# EAGLE design 3K_valdiklis_v1.2 (EAGLE 6.4)
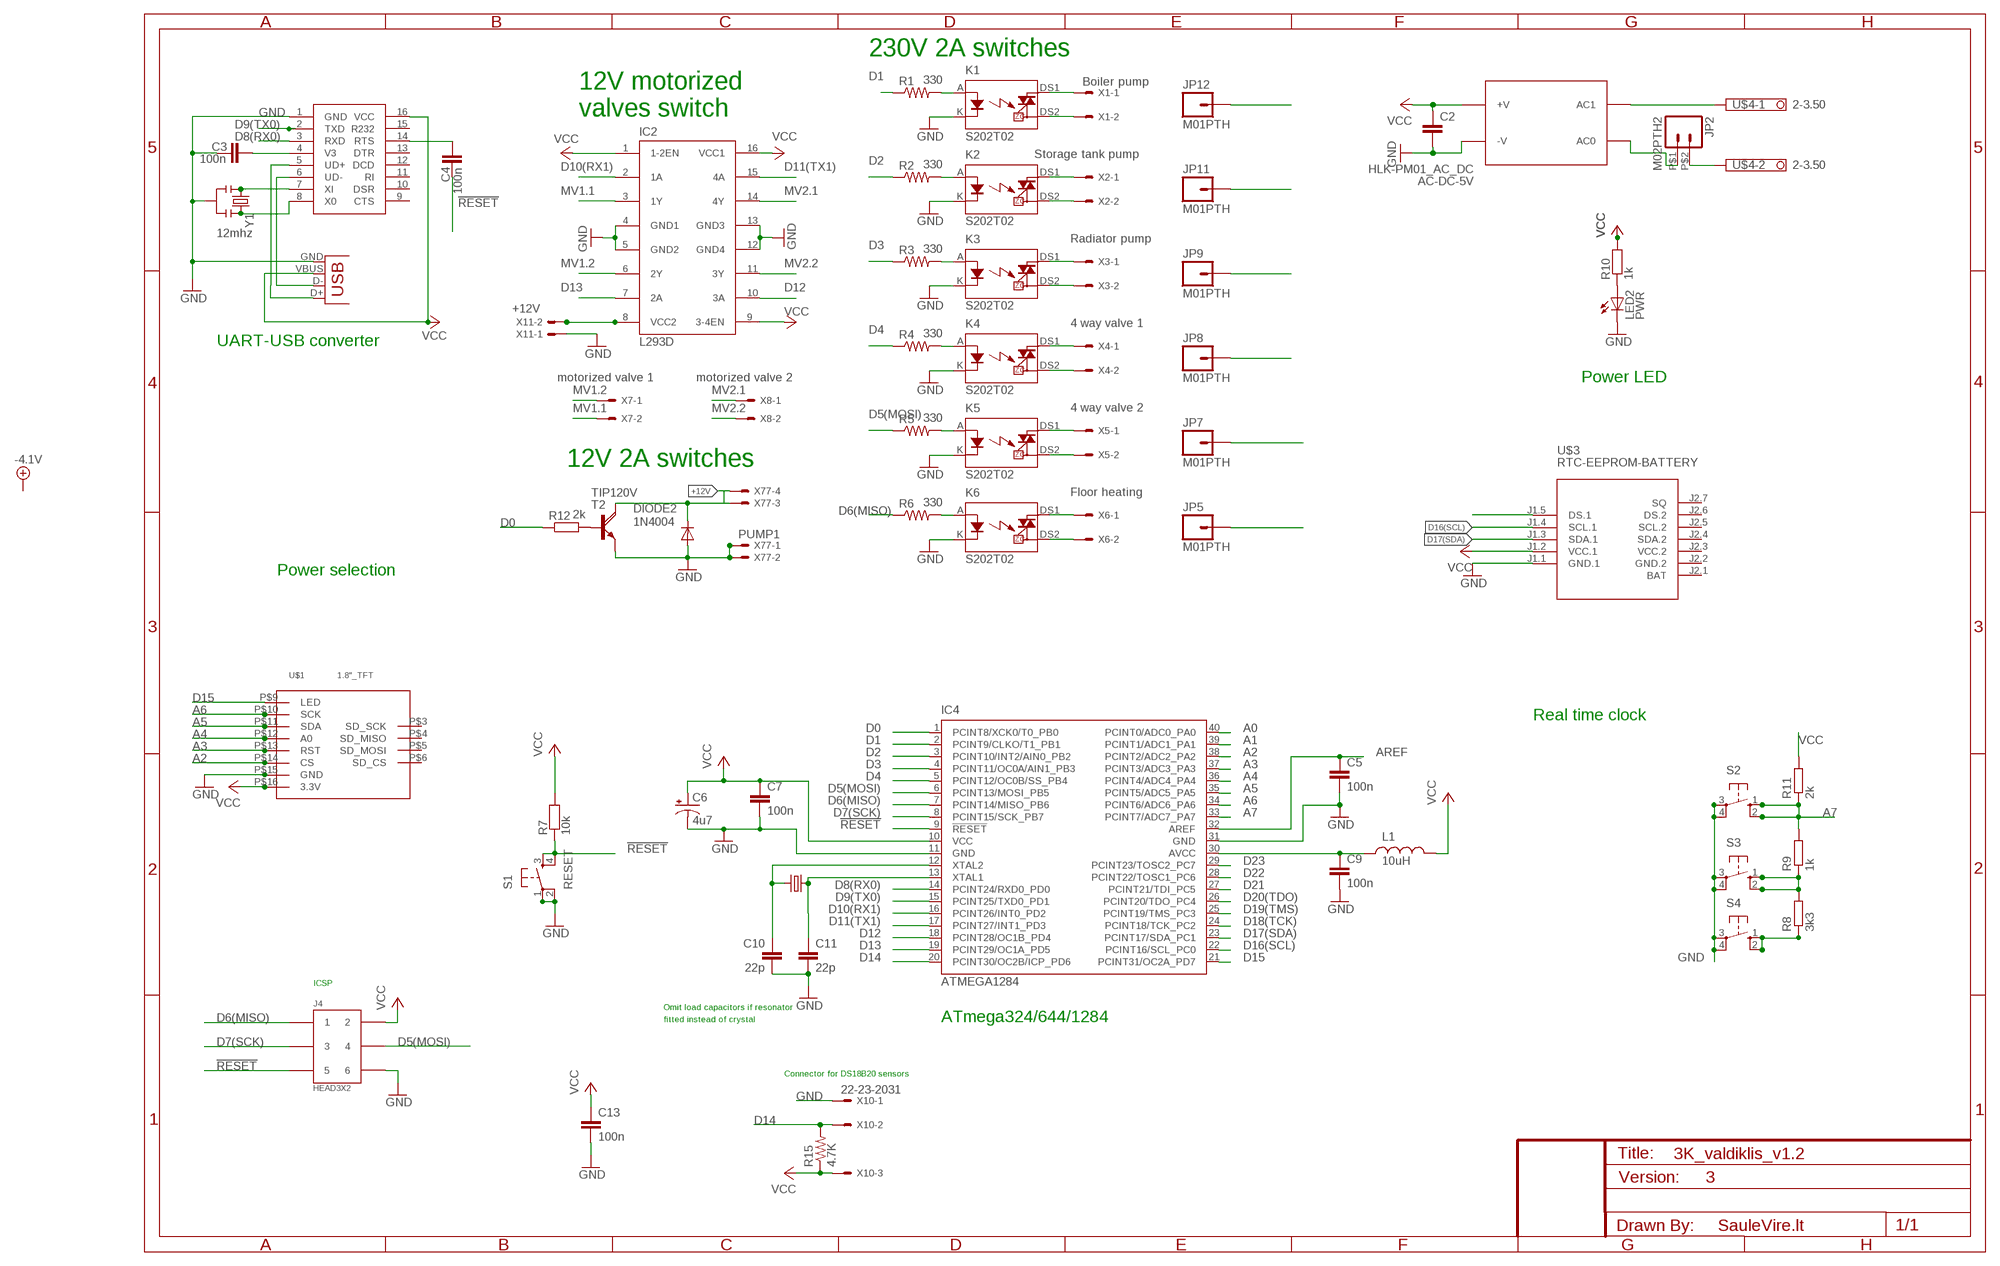
[diagram p0: schematic, sheet 1]

## Parts
AC-DC-5V  HLK-PM01_AC_DC  [HLK-PM01_AC_DC]
C2  C-EU025-024X044  [C025-024X044]
C3  100n  CAPPTH  [CAP-PTH-SMALL]
C4  100n  CAPPTH  [CAP-PTH-SMALL]
C5  100n  CAPPTH  [CAP-PTH-SMALL]
C6  4u7  CAP_POLPTH2  [CPOL-RADIAL-10UF-25V]
C7  100n  CAPPTH  [CAP-PTH-SMALL]
C9  100n  CAPPTH  [CAP-PTH-SMALL]
C10  22p  CAPPTH  [CAP-PTH-SMALL]
C11  22p  CAPPTH  [CAP-PTH-SMALL]
C13  100n  CAPPTH  [CAP-PTH-SMALL]
DIODE2  1N4004  [DO41-10]
IC2  L293D  [DIL16]
IC4  ATMEGA1284  ATMEGA644-20PU  [DIL40]
J4  HEAD3X2  [HEAD3X2]
JP2  M02PTH2  [1X02_BIG]
JP3  USB-B  USBPTH  [USB-B-PTH]
JP5  M01PTH  [1X01]
JP7  M01PTH  [1X01]
JP8  M01PTH  [1X01]
JP9  M01PTH  [1X01]
JP11  M01PTH  [1X01]
JP12  M01PTH  [1X01]
K1  S202T02  [S202T02]
K2  S202T02  [S202T02]
K3  S202T02  [S202T02]
K4  S202T02  [S202T02]
K5  S202T02  [S202T02]
K6  S202T02  [S202T02]
L1  10uH  INDUCTOR0.4"-AXIAL  [RES-AXIAL-0.4]
LED2  PWR  LED3MM  [LED3MM]
R1  330  R-US_0207/10  [0207/10]
R2  330  R-US_0207/10  [0207/10]
R3  330  R-US_0207/10  [0207/10]
R4  330  R-US_0207/10  [0207/10]
R5  330  R-US_0207/10  [0207/10]
R6  330  R-US_0207/10  [0207/10]
R7  10k  RESISTOR  [RES-AXIAL-0.4]
R8  3k3  R-EU_0207/10  [0207/10]
R9  1k  R-EU_0207/10  [0207/10]
R10  1k  RESISTOR  [RES-AXIAL-0.4]
R11  2k  R-EU_0207/10  [0207/10]
R12  2k  R-EU_0207/10  [0207/10]
R15  4.7K  R-US_0207/10  [0207/10]
S1  RESET  TAC_SWITCHPTH  [TACTILE-PTH]
S2  10-XX  [B3F-10XX]
S3  10-XX  [B3F-10XX]
S4  10-XX  [B3F-10XX]
T2  TIP120V  [TO220AV]
U$1  1.8"_TFT  [1.8"_TFT]
U$2  CH340G  [SO016]
U$3  RTC-EEPROM-BATTERY  [RTC_EEPROM_BATTERY]
U$4  2-3.50  [2-3.50]
X1  Boiler pump  22-23-2021  [22-23-2021]
X2  Storage tank pump  22-23-2021  [22-23-2021]
X3  Radiator pump  22-23-2021  [22-23-2021]
X4  4 way valve 1  22-23-2021  [22-23-2021]
X5  4 way valve 2  22-23-2021  [22-23-2021]
X6  Floor heating  22-23-2021  [22-23-2021]
X7  motorized valve 1  22-23-2021  [22-23-2021]
X8  motorized valve 2  22-23-2021  [22-23-2021]
X9  16MHz  CRYSTALHC49US  [HC49US]
X10  22-23-2031  [22-23-2031]
X11  +12V  22-23-2021  [22-23-2021]
X77  PUMP1  22-23-2041  [22-23-2041]
Y1  12mhz  RESONATORPTH  [RESONATOR-PTH]

## Nets
220V [220v]: AC-DC-5V.AC1 U$4.1
!RESET: C4.1 IC4.9(!RESET) J4.5 R7.P$1 S1.3 S1.4
+12V: DIODE2.C T2.C X77.3 X77.4
A0: IC4.40(PCINT0/ADC0_PA0)
A1: IC4.39(PCINT1/ADC1_PA1)
A2: IC4.38(PCINT2/ADC2_PA2) U$1.P$14(CS)
A3: IC4.37(PCINT3/ADC3_PA3) U$1.P$13(RST)
A4: IC4.36(PCINT4/ADC4_PA4) U$1.P$12(A0)
A5: IC4.35(PCINT5/ADC5_PA5) U$1.P$11(SDA)
A6: IC4.34(PCINT6/ADC6_PA6) U$1.P$10(SCK)
A7: IC4.33(PCINT7/ADC7_PA7) R9.2 R11.1 S2.1(S) S2.2(S1)
AREF: C5.1 IC4.32(AREF)
AVCC [vcc]: C9.1 IC4.30(AVCC) L1.P$1
D0: IC4.1(PCINT8/XCK0/T0_PB0) R12.1
D1: IC4.2(PCINT9/CLKO/T1_PB1) R1.1
D2: IC4.3(PCINT10/INT2/AIN0_PB2) R2.1
D3: IC4.4(PCINT11/OC0A/AIN1_PB3) R3.1
D4: IC4.5(PCINT12/OC0B/SS_PB4) R4.1
D5(MOSI): IC4.6(PCINT13/MOSI_PB5) J4.4 R5.1
D6(MISO): IC4.7(PCINT14/MISO_PB6) J4.1 R6.1
D7(SCK): IC4.8(PCINT15/SCK_PB7) J4.3
D8(RX0): IC4.14(PCINT24/RXD0_PD0) U$2.3(RXD)
D9(TX0): IC4.15(PCINT25/TXD0_PD1) U$2.2(TXD)
D10(RX1): IC2.2(1A) IC4.16(PCINT26/INT0_PD2)
D11(TX1): IC2.15(4A) IC4.17(PCINT27/INT1_PD3)
D12: IC2.10(3A) IC4.18(PCINT28/OC1B_PD4)
D13: IC2.7(2A) IC4.19(PCINT29/OC1A_PD5)
D14: IC4.20(PCINT30/OC2B/ICP_PD6) R15.2 X10.2
D15: IC4.21(PCINT31/OC2A_PD7) U$1.P$9(LED)
D16(SCL): IC4.22(PCINT16/SCL_PC0) U$3.J1.4(SCL.1)
D17(SDA): IC4.23(PCINT17/SDA_PC1) U$3.J1.3(SDA.1)
D18(TCK): IC4.24(PCINT18/TCK_PC2)
D19(TMS): IC4.25(PCINT19/TMS_PC3)
D20(TDO): IC4.26(PCINT20/TDO_PC4)
D21: IC4.27(PCINT21/TDI_PC5)
D22: IC4.28(PCINT22/TOSC1_PC6)
D23: IC4.29(PCINT23/TOSC2_PC7)
GND [vcc]: AC-DC-5V.-V C2.2 C3.1 C5.2 C6.2(-) C7.2 C9.2 C10.2 C11.2 C13.2 DIODE2.A IC2.4(GND1) IC2.5(GND2) IC2.12(GND4) IC2.13(GND3) IC4.11(GND) IC4.31(GND) J4.6 JP3.GND K1.K K2.K K3.K K4.K K5.K K6.K LED2.K(C) S1.1 S1.2 S2.3(P) S2.4(P1) S3.3(P) S3.4(P1) S4.3(P) S4.4(P1) T2.E U$1.P$15(GND) U$2.1(GND) U$3.J1.1(GND.1) X10.1 X11.1 X77.1 X77.2 Y1.2
MV1.1: IC2.3(1Y) X7.2
MV1.2: IC2.6(2Y) X7.1
MV2.1: IC2.14(4Y) X8.1
MV2.2: IC2.11(3Y) X8.2
N$1: C11.1 IC4.13(XTAL1) X9.1
N$2: C10.1 IC4.12(XTAL2) X9.2
N$3 [220v]: AC-DC-5V.AC0 JP2.P$1
N$4 [220v]: JP2.P$2 U$4.2
N$6: R8.1 S4.1(S) S4.2(S1)
N$7: U$2.7(XI) Y1.1
N$8: LED2.A R10.P$1
N$9: U$2.8(X0) Y1.3
N$10: R8.2 R9.1 S3.1(S) S3.2(S1)
N$11: C4.2 U$2.14(RTS)
N$12: JP3.D- U$2.6(UD-)
N$13: R12.2 T2.B
N$14: C3.2 U$2.4(V3)
N$16: K3.A R3.2
N$18 [220v]: JP9.1 K3.DS1 X3.1
N$19: IC2.8(VCC2) X11.2
N$22: JP3.D+ U$2.5(UD+)
N$23 [220v]: K3.DS2 X3.2
N$24: K2.A R2.2
N$25 [220v]: JP11.1 K2.DS1 X2.1
N$26 [220v]: K2.DS2 X2.2
N$28: K4.A R4.2
N$29 [220v]: JP8.1 K4.DS1 X4.1
N$30 [220v]: K4.DS2 X4.2
N$31: K1.A R1.2
N$32 [220v]: JP12.1 K1.DS1 X1.1
N$33 [220v]: K1.DS2 X1.2
N$34: K6.A R6.2
N$35 [220v]: JP5.1 K6.DS1 X6.1
N$36 [220v]: K6.DS2 X6.2
N$37: K5.A R5.2
N$38 [220v]: JP7.1 K5.DS1 X5.1
N$39 [220v]: K5.DS2 X5.2
N$40: U$3.J1.5(DS.1)
VCC [vcc]: AC-DC-5V.+V C2.1 C6.1(+) C7.1 C13.1 IC2.1(1-2EN) IC2.9(3-4EN) IC2.16(VCC1) IC4.10(VCC) J4.2 JP3.VBUS L1.P$2 R7.P$2 R10.P$2 R11.2 R15.1 U$1.P$16(3.3V) U$2.16(VCC) U$3.J1.2(VCC.1) X10.3
Unconnected: U$1.P$3(SD_SCK) U$1.P$4(SD_MISO) U$1.P$5(SD_MOSI) U$1.P$6(SD_CS) U$2.9(CTS) U$2.10(DSR) U$2.11(RI) U$2.12(DCD) U$2.13(DTR) U$2.15(R232) U$3.J2.1(BAT) U$3.J2.4(SDA.2) U$3.J2.5(SCL.2) U$3.J2.6(DS.2) U$3.J2.7(SQ)

## Notes on the sheet
- 230V 2A switches
- 12V motorized 
  valves switch
- UART-USB converter
- Power LED
- 12V 2A switches
- Power selection
- Real time clock
- ICSP
- Omit load capacitors if resonator
- fitted instead of crystal | ATmega324/644/1284
- Connector for DS18B20 sensors
- 3
- SauleVire.lt

## Power pins joined to a net without a drawn wire
GND.2: U$3.J2.2(GND.2)
VCC.2: U$3.J2.3(VCC.2)

## Library data of the parts
AC-DC-5V = HLK-PM01:HLK-PM01_AC_DC: Ultra-compact power module HLK-PM01, http://www.hlktech.net AC-DC 220V to 5V Step Down Power Supply Module Device model created 2016-01-23 by Alvydas. http://www.saulevire.lt
C2 = rcl-1:C-EU: CAPACITOR, European symbol
C3-C5 C7 C9 C13 = SparkFun:CAP: Capacitor Standard 0603 ceramic capacitor, and 0.1" leaded capacitor.
C6 = SparkFun:CAP_POL: Capacitor Polarized These are standard SMD and PTH capacitors. Normally 10uF, 47uF, and 100uF in electrolytic and tantalum varieties. Always verify the external diameter of the through hole cap, it varies with capacity, voltage, and manufacturer. The EIA devices should be standard.
C10 C11 = SparkFun:CAP: Capacitor Standard 0603 ceramic capacitor, and 0.1" leaded capacitor.; OPTION: Do not fit for ceramic resonator
DIODE2 = diode:1N4004: DIODE general purpose rectifier, 1 A
IC2 = st-microelectronics:L293D: PUSH-PULL 4 CHANNEL DRIVER; MPN: L293D; OC_FARNELL: 9589619; OC_NEWARK: 56P8249
IC4 = SteveMarple:ATMEGA644-*PU: 8-bit Microcontroller with 64K Bytes In-System Programmable Flash Auto generated by make-symbol-device-package-bsdl.ulp Rev. 34 Source: http://www.atmel.com/dyn/resources/prod_documents/doc2593.pdf; MPN: ATMEGA644-20PU; OC_FARNELL: 1288340; OC_NEWARK: 23M5060
J4 = MyCON2:HEAD3X2
JP2 = SparkFun-Connectors-1:M02: Standard 2-pin 0.1" header. Use with - straight break away headers ( PRT-00116) - right angle break away headers (PRT-00553) - swiss pins (PRT-00743) - machine pins (PRT-00117) - female headers (PRT-00115) Molex polarized connector foot print use with: PRT-08233 with associated crimp pins and housings. 2.54_SCREWTERM for use with PRT-10571. 3.5mm Screw Terminal footprints for PRT-08084 5mm Screw Terminal footprints for use with PRT-08433
JP3 = SparkFun-Connectors-1:USB: USB Connectors USB-B-PTH is fully proven SKU : PRT-00139/CONN-08278 USB-miniB is fully proven SKU : PRT-00587 USB-A-PCB is untested. USB-A-H is throughly reviewed, but untested. Spark Fun Electronics SKU : PRT-00437 USB-B-SMT is throughly reviewed, but untested. Needs silkscreen touching up. USB-A-S has not been used/tested USB-MB-H has not been used/tested USB-MICROB has been used. CONN-09505; PROD_ID: CONN-08278
JP5 JP7-JP9 JP11 JP12 = SparkFun-Connectors-1:M01: Header 1 Standard 1-pin 0.1" header. Use with straight break away headers (SKU : PRT-00116), right angle break away headers (PRT-00553), swiss pins (PRT-00743), machine pins (PRT-00117), and female headers (PRT-00115).
K1-K6 = relay-1:S202T02
L1 = SteveMarple:INDUCTOR: Inductors Basic Inductor/Choke - 0603 and 1206. Footprints are not proven and vary greatly between part numbers.
LED2 = SparkFun:LED: LEDs Standard schematic elements and footprints for 5mm, 3mm, 1206, and 0603 sized LEDs. 5mm - Spark Fun Electronics SKU : COM-00529 (and others)
R1-R6 = resistor-1:R-US_: RESISTOR, American symbol
R7 R10 = SteveMarple:RESISTOR: 1/4W PTH resistor
R8 R9 R11 R12 = resistor:R-EU_: RESISTOR, European symbol
R15 = adafruit:R-US_: RESISTOR, American symbol
S1 = SparkFun:TAC_SWITCH: Momentary Switch Button commonly used for reset or general input. Spark Fun Electronics SKU : COM-00097
S2-S4 = switch-omron:10-XX: OMRON SWITCH; MPN: B3F-1000; OC_FARNELL: 176432; OC_NEWARK: 36M3542
T2 = rocketfarm:TIP120: NPN DARLINGTON TRANSISTOR
U$1 = tft_1.8_1.44_oled_0.96:1.8"_TFT
U$2 = ch340:CH340G: CH340G
U$3 = diy-modules-1:RTC-EEPROM-BATTERY: RTC Module with Battery and EEPROM based on DS1307 and AT24C32 chips
U$4 = con-phoenix-350-1:2-3.50
X1-X8 X11 = con-molex:22-23-2021: .100" (2.54mm) Center Header - 2 Pin; MF: MOLEX; MPN: 22-23-2021; OC_FARNELL: 1462926; OC_NEWARK: 25C3832
X9 = SparkFun:CRYSTAL: Crystals Various standard crystals. Proven footprints. Spark Fun Electronics SKU : COM-00534
X10 = con-molex:22-23-2031: .100" (2.54mm) Center Header - 3 Pin; MF: MOLEX; MPN: 22-23-2031; OC_FARNELL: 1462950; OC_NEWARK: 30C0862
X77 = con-molex:22-23-2041: .100" (2.54mm) Center Header - 4 Pin; MF: MOLEX; MPN: 22-23-2041; OC_FARNELL: 1462920; OC_NEWARK: 38C0355
Y1 = SparkFun-FreqCtrl:RESONATOR: Resonator Small SMD resonator. Used, eg, on the Arduino Pro/ Pro Mini boards. 8MHz- XTAL-08895 16MHz- XTAL-08900

## Net classes
1 vcc: width 0.5 mm
4 gnd: width 0.5 mm
5 220v: width 0.5 mm

## Board
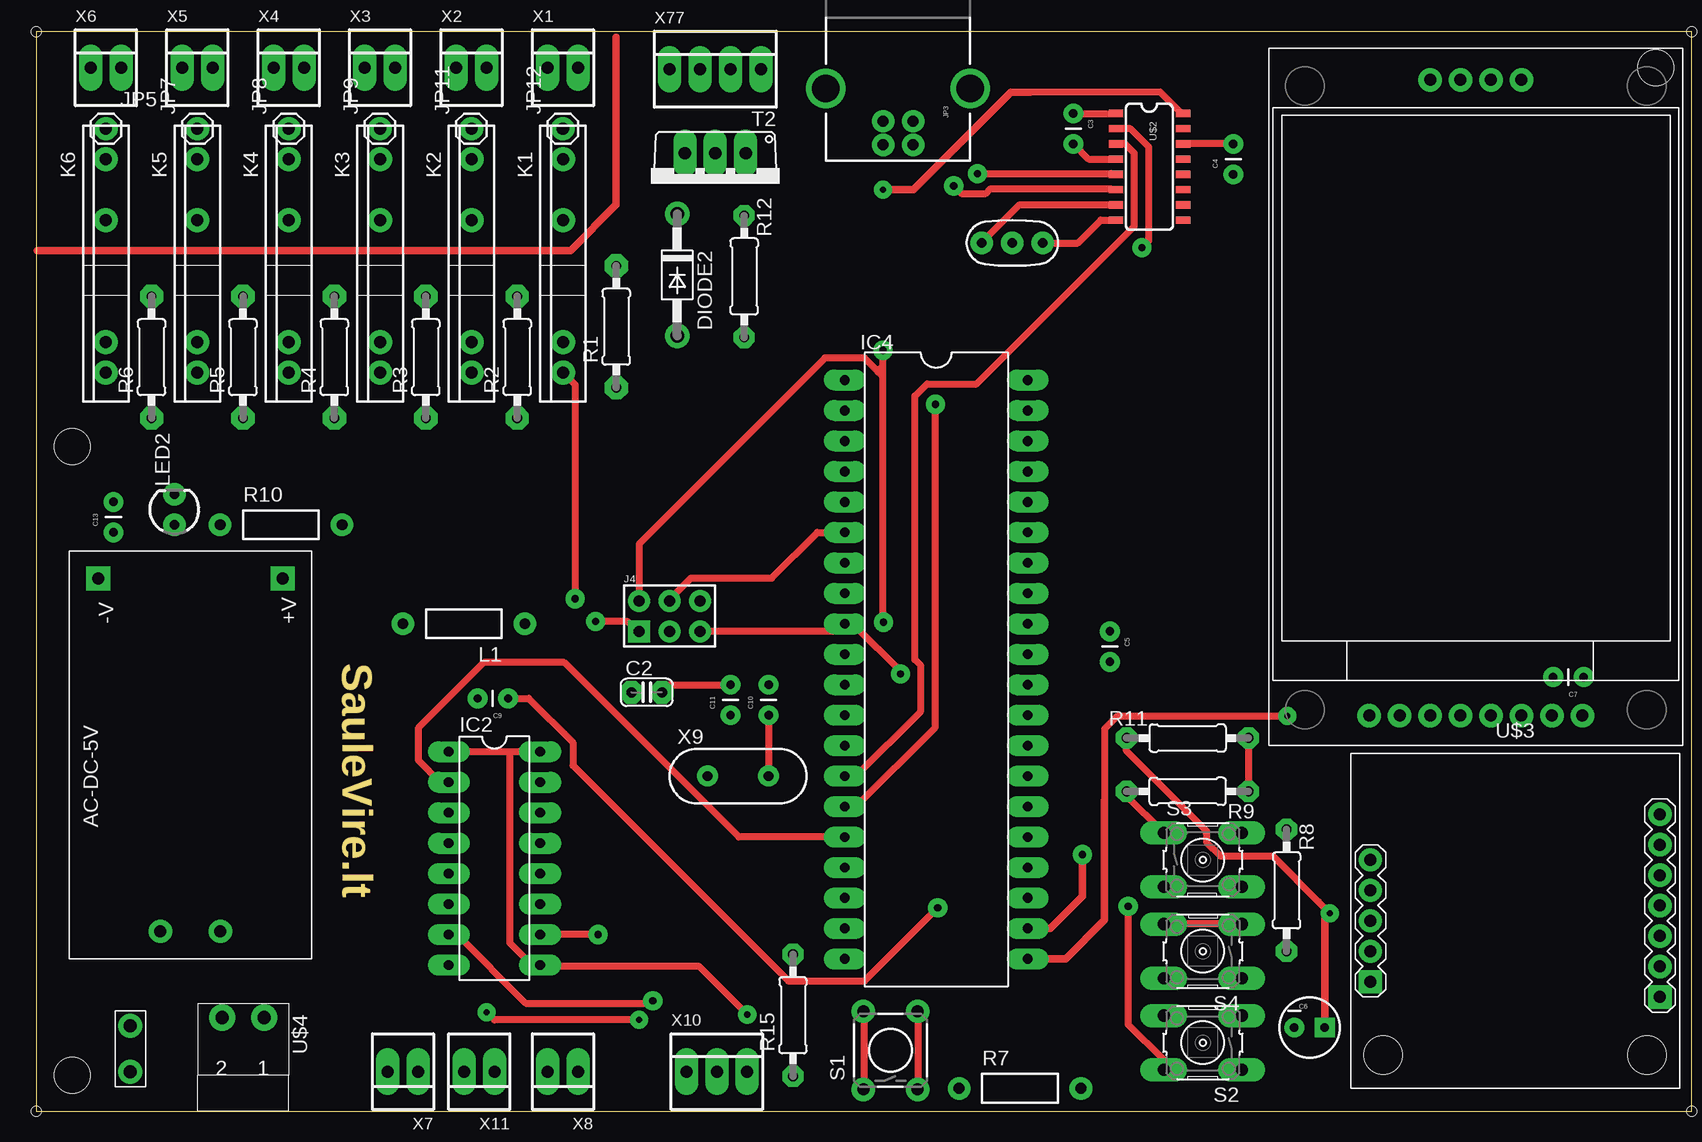
[diagram p1: board, top side]
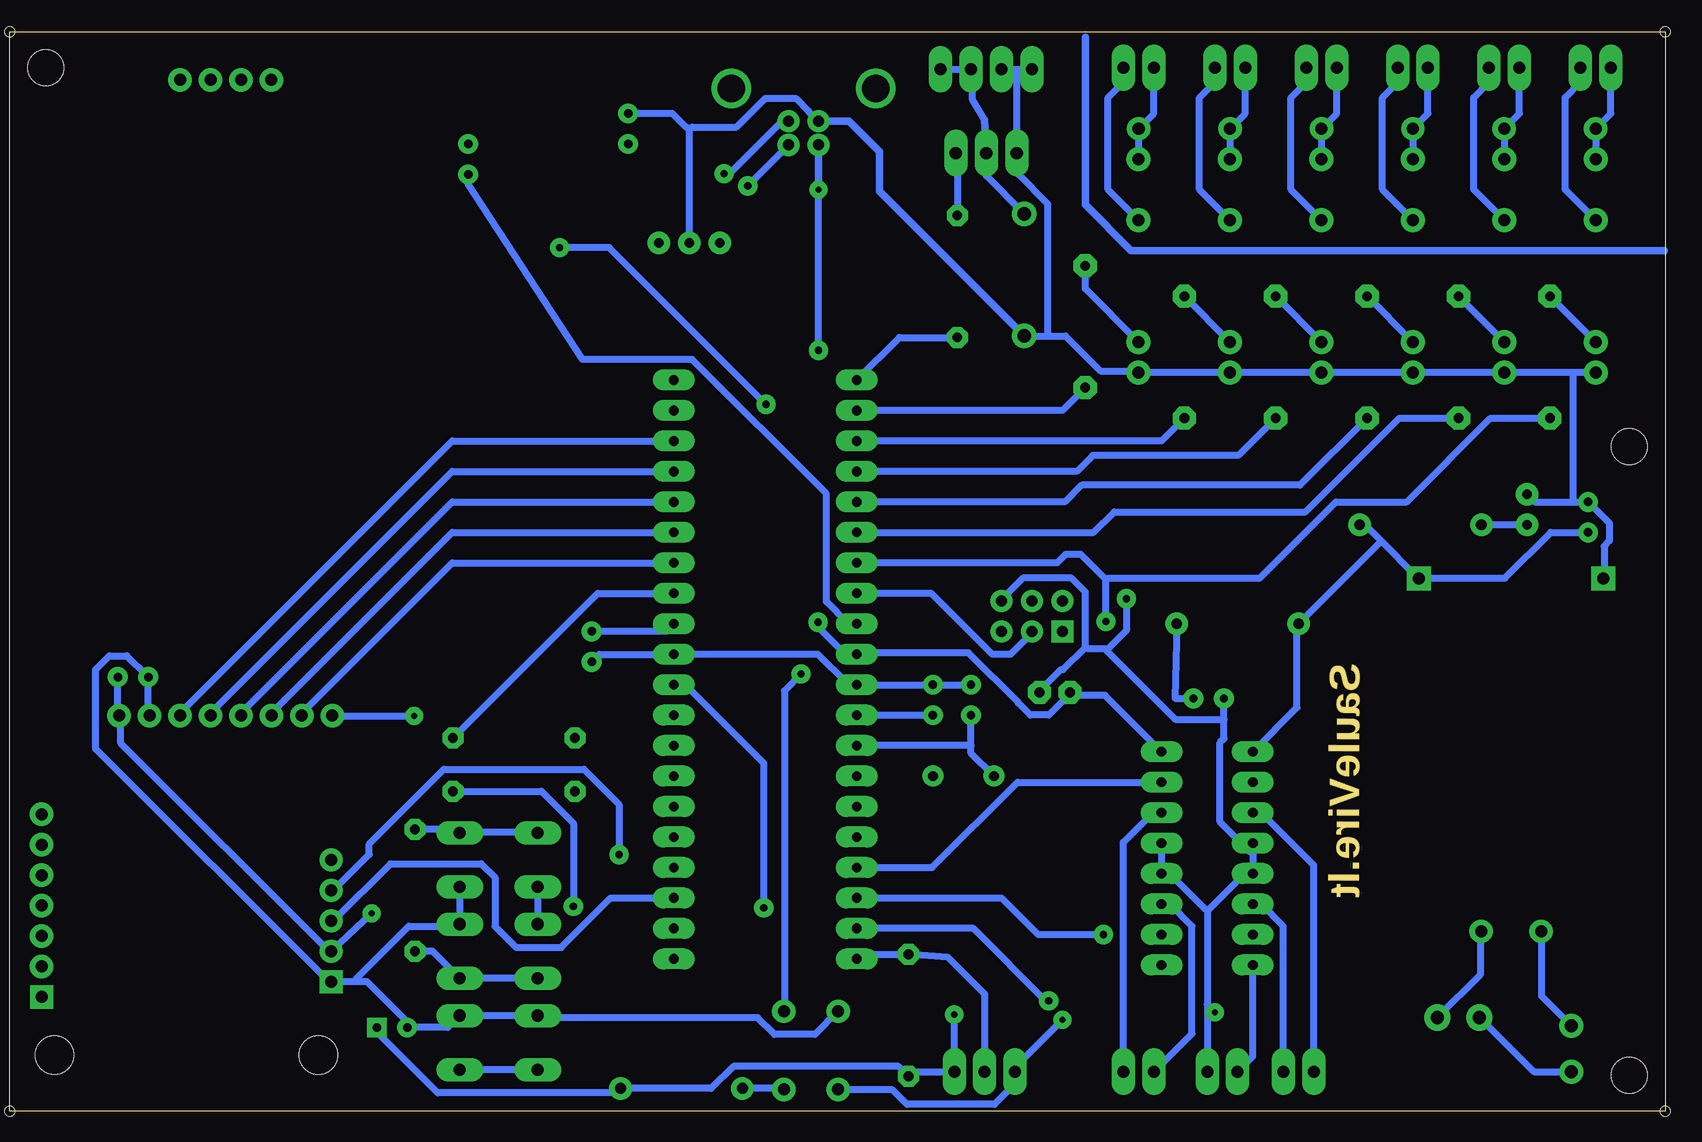
[diagram p2: board, bottom side, seen from below]

No outline drawn. Coordinates in mm, seen from the top.
Copper layers (1*16): Top 0.035mm / dielectric 1.5mm / Bottom 0.035mm
Design rules "3K_valdiklis_v1 *": minimum track width 0.6mm, minimum drill 0.6mm, track to track 0.6mm, track to pad 0.6mm, pad to pad 0.6mm, via to via 0.6mm, smd to smd 0.6mm, copper to edge 0.6mm, drill to drill 0.6mm, minimum pad ring 0.47mm, minimum via ring 0.5mm, stop-mask expansion 0.6mm, vias tented up to drill 0.6mm, thermal gap 0.6mm
Holes 3 mm at 3.05,55.42 135.05,87 3.05,3
Holes 0.8 mm at 0.05,0 0.05,90 138.05,90 138.05,0
Milling: 4 lines

### Footprints (pad centres in the part's own frame; a part is rotated, then mirrored left to right if it is on the bottom)
HLK-PM01_AC_DC = drill 1 pad 2 square: +V 31.7,2.4; -V 31.7,17.8 | drill 1: AC0 2.3,12.6; AC1 2.3,7.6
C025-024X044 = drill 0.813 pad 1.93 octagon: 1 -1.27,0; 2 1.27,0
CAP-PTH-SMALL = drill 0.7 pad 1.651: 1 0,0; 2 2.54,0
CPOL-RADIAL-10UF-25V = drill 0.7 pad 1.651 square: 1 1.27,0 | drill 0.7 pad 1.651: 2 -1.27,0
DO41-10 = drill 1.118: A 5.08,0; C -5.08,0
DIL16 = drill 0.813 long: 1 -8.89,-3.81; 2 -6.35,-3.81; 3 -3.81,-3.81; 4 -1.27,-3.81; 5 1.27,-3.81; 6 3.81,-3.81; 7 6.35,-3.81; 8 8.89,-3.81; 9 8.89,3.81; 10 6.35,3.81; 11 3.81,3.81; 12 1.27,3.81; 13 -1.27,3.81; 14 -3.81,3.81; 15 -6.35,3.81; 16 -8.89,3.81
DIL40 = drill 0.813 long: 1 -24.13,-7.62; 2 -21.59,-7.62; 3 -19.05,-7.62; 4 -16.51,-7.62; 5 -13.97,-7.62; 6 -11.43,-7.62; 7 -8.89,-7.62; 8 -6.35,-7.62; 9 -3.81,-7.62; 10 -1.27,-7.62; 11 1.27,-7.62; 12 3.81,-7.62; 13 6.35,-7.62; 14 8.89,-7.62; 15 11.43,-7.62; 16 13.97,-7.62; 17 16.51,-7.62; 18 19.05,-7.62; 19 21.59,-7.62; 20 24.13,-7.62; 21 24.13,7.62; 22 21.59,7.62; 23 19.05,7.62; 24 16.51,7.62; 25 13.97,7.62; 26 11.43,7.62; 27 8.89,7.62; 28 6.35,7.62; 29 3.81,7.62; 30 1.27,7.62; 31 -1.27,7.62; 32 -3.81,7.62; 33 -6.35,7.62; 34 -8.89,7.62; 35 -11.43,7.62; 36 -13.97,7.62; 37 -16.51,7.62; 38 -19.05,7.62; 39 -21.59,7.62; 40 -24.13,7.62
HEAD3X2 = drill 0.914 pad 1.778 square: 1 0,0 | drill 0.914 pad 1.778: 2 0,2.54; 3 2.54,0; 4 2.54,2.54; 5 5.08,0; 6 5.08,2.54
1X02_BIG = drill 1.067 pad 1.93: P$1 0,0; P$2 3.81,0
USB-B-PTH = drill 0.914 pad 1.676: D+ 0,1.25; D- 1.981,1.25; GND 0,-1.25; VBUS 1.981,-1.25 | drill 2.286: S1 -2.718,-6.02; S2 -2.718,6.02
1X01 = drill 1.016 pad 1.88: 1 0,0
S202T02 = drill 1 pad 2: A 10.16,0; DS1 -5.08,0; DS2 0,0; K 12.7,0
RES-AXIAL-0.4 = drill 0.9 pad 1.88: P$1 -5.08,0; P$2 5.08,0
LED3MM = drill 0.813 pad 1.88: A -1.27,0; K 1.27,0
0207/10 = drill 0.813 pad 1.93 octagon: 1 -5.08,0; 2 5.08,0
0207/10' = drill 0.813 octagon: 1 -5.08,0; 2 5.08,0
0207/10'' = drill 0.813 pad 1.676 octagon: 1 -5.08,0; 2 5.08,0
TACTILE-PTH = drill 1.016 pad 1.88: 1 -3.251,2.261; 2 3.251,2.261; 3 -3.251,-2.261; 4 3.251,-2.261
B3F-10XX = drill 1.016 long: 1 -3.251,2.261; 2 3.251,2.261; 3 -3.251,-2.261; 4 3.251,-2.261
TO220AV = drill 1.016 long: B -2.54,-2.54; C 0,-2.54; E 2.54,-2.54
1.8"_TFT = drill 1 pad 1.778: P$3 55.5,21.05; P$4 55.5,18.52; P$5 55.5,15.98; P$6 55.5,13.44; P$9 2.5,26.14; P$10 2.5,23.6; P$11 2.5,21.06; P$12 2.5,18.52; P$13 2.5,15.98; P$14 2.5,13.44; P$15 2.5,10.9; P$16 2.5,8.36
SO016 = smd 0.6 x 1.2: 1 -4.445,-2.8; 2 -3.175,-2.8; 3 -1.905,-2.8; 4 -0.635,-2.8; 5 0.635,-2.8; 6 1.905,-2.8; 7 3.175,-2.8; 8 4.445,-2.8; 9 4.445,2.8; 10 3.175,2.8; 11 1.905,2.8; 12 0.635,2.8; 13 -0.635,2.8; 14 -1.905,2.8; 15 -3.175,2.8; 16 -4.445,2.8
RTC_EEPROM_BATTERY = drill 1 square: J1.1 -12.065,-5.08; J2.1 12.065,-6.35 | drill 1: J1.2 -12.065,-2.54; J1.3 -12.065,0; J1.4 -12.065,2.54; J1.5 -12.065,5.08; J2.2 12.065,-3.81; J2.3 12.065,-1.27; J2.4 12.065,1.27; J2.5 12.065,3.81; J2.6 12.065,6.35; J2.7 12.065,8.89 | hole 3.2: -11,-11.176; 11,-11.176
2-3.50 = drill 1.1 pad 2.184: 1 2.05,1.2; 2 5.55,1.2
22-23-2021 = drill 1 long: 1 -1.27,0; 2 1.27,0
HC49US = drill 0.813: 1 -2.54,0; 2 2.54,0
22-23-2031 = drill 1 long: 1 -2.54,0; 2 0,0; 3 2.54,0
22-23-2041 = drill 1 long: 1 -3.81,0; 2 -1.27,0; 3 1.27,0; 4 3.81,0
RESONATOR-PTH = drill 0.8 pad 1.88: 1 -2.54,0; 2 0,0; 3 2.54,0

### Placement (x,y rotation side)
AC-DC-5V  22.99,12.7 90 top
C2  50.93,34.92 0 top
C3  86.49,83.19 270 top
C4  99.82,78.11 90 top
C5  89.53,40.01 270 top
C6  106.17,6.99 0 top
C7  129.03,36.2 180 top
C9  39.37,34.42 180 top
C10  61.09,33.02 90 top
C11  57.91,33.02 90 top
C13  6.48,48.26 90 top
DIODE2  53.47,69.72 270 top
IC2  38.23,21.08 270 top
IC4  75.06,36.83 270 top
J4  50.29,40.01 0 top
JP2  7.87,7.11 270 top
JP3  71.88,82.55 270 top
JP5  5.84,81.92 0 top
JP7  13.46,81.92 90 top
JP8  21.08,81.92 90 top
JP9  28.7,81.92 90 top
JP11  36.32,81.92 90 top
JP12  43.94,81.92 90 top
K1  43.94,74.3 270 top
K2  36.32,74.3 270 top
K3  28.7,74.3 270 top
K4  21.08,74.3 270 top
K5  13.46,74.3 270 top
K6  5.84,74.3 270 top
L1  35.69,40.64 180 top
LED2  11.56,50.16 90 top
R1  48.39,65.41 90 top
R2  40.13,62.87 90 top
R3  32.51,62.87 90 top
R4  24.89,62.87 90 top
R5  17.27,62.87 90 top
R6  9.65,62.87 90 top
R7  82.04,1.91 0 top
R8  3k3  [0207/10']  104.27,18.41 90 top
R9  1k  [0207/10']  96.01,26.67 0 top
R10  20.45,48.9 0 top
R11  2k  [0207/10']  96.01,31.11 180 top
R12  2k  [0207/10']  59.05,69.6 90 top
R15  4.7K  [0207/10'']  63.12,8 90 top
S1  71.25,5.08 90 top
S2  97.28,5.71 180 top
S3  97.28,20.95 0 top
S4  97.28,13.34 180 top
T2  56.64,77.34 180 top
U$1  137.29,30.48 90 top
U$2  92.84,78.74 270 top
U$3  123.32,15.88 0 top
U$4  21.08,9.02 180 top
X1  43.94,87 0 top
X2  36.32,87 0 top
X3  28.7,87 0 top
X4  21.08,87 0 top
X5  13.46,87 0 top
X6  5.84,87 0 top
X7  30.61,3.3 180 top
X8  43.94,3.3 180 top
X9  58.55,27.94 0 top
X10  56.77,3.3 0 top
X11  36.96,3.3 180 top
X77  56.64,86.87 0 top
Y1  81.41,72.39 0 top

### Tracks (layer width: path | path; a pad name or v marks a point on that pad's centre or on a via)
220V
  Bottom 0.6: AC-DC-5V.AC1 15.43,14.99 15.43,11.43 18.99,7.87 U$4.1
!RESET  (via drill 0.6)
  Top 0.6: v72.07,36.45 72.07,36.7 68.26,40.51 67.69,40.51 IC4.9 67.18,40.51 66.67,40.01 J4.5 | S1.3 73.53,1.84 73.53,8.32 S1.4
  Bottom 0.6: R7.P$1 73.6,1.91 73.53,1.84 S1.3 | C4.1 99.82,77.28 90.3,62.67 81.15,62.67 69.98,51.5 69.98,42.48 68.14,40.64 IC4.9 | v72.07,36.45 73.47,35.05 73.47,8.38 S1.4
+12V
  Bottom 0.6: X77.4 X77.3 57.78,86.61 57.78,84.33 56.77,82.68 | T2.C 56.64,77.98 DIODE2.C
  Bottom 0.61: 56.77,82.68 T2.C
A2
  Bottom 0.6: IC4.38 101.16,55.88 123.83,33.21 123.83,33.02 U$1.P$14
A3
  Bottom 0.6: IC4.37 101.16,53.34 121.28,33.21 121.28,33.02 U$1.P$13
A4
  Bottom 0.6: IC4.36 101.16,50.8 118.75,33.21 118.75,33.02 U$1.P$12
A5
  Bottom 0.6: IC4.35 101.16,48.26 116.2,33.21 116.2,33.02 U$1.P$11
A6
  Bottom 0.6: IC4.34 101.16,45.72 113.67,33.21 113.67,33.02 U$1.P$10
A7  (via drill 0.6)
  Top 0.6: R11.1 R9.2 | v91.06,17.08 91.06,7.24 93.98,4.32 93.98,3.49 S2.2
  Bottom 0.6: S2.2 94.04,3.49 100.52,3.49 S2.1 | IC4.33 89.03,43.18 R11.1 | v91.06,17.08 91.06,24 93.73,26.67 R9.2
AREF
  Bottom 0.6: C5.1 83.31,40.01 IC4.32
AVCC  (via drill 0.6)
  Top 0.6: v75.18,16.95 69.09,10.86 62.74,10.86 44.77,28.83 44.77,30.73 41.08,34.42 C9.1
  Bottom 0.6: C9.1 40.89,34.42 L1.P$1 | IC4.30 81.72,35.56 75.18,29.02 v75.18,16.95
D0
  Bottom 0.6: R12.1 63.88,64.52 IC4.1
D1
  Bottom 0.6: IC4.2 50.29,58.42 R1.1
D2
  Bottom 0.6: IC4.3 42.04,55.88 R2.1
D3
  Bottom 0.6: IC4.4 49.09,53.34 47.75,54.67 35.62,54.67 R3.1
D4
  Bottom 0.6: IC4.5 50.1,50.8 48.7,52.2 30.48,52.2 R4.1
D5(MOSI)
  Top 0.6: IC4.6 65.15,48.26 61.34,44.45 54.61,44.45 52.83,42.67 J4.4
  Bottom 0.6: R5.1 22.23,57.78 30.04,49.97 45.97,49.97 47.69,48.26 IC4.6
D6(MISO)  (via drill 0.6)
  Top 0.6: v46.67,40.83 49.34,40.83 50.16,40.01 J4.1
  Bottom 0.6: IC4.7 50.74,45.72 50.04,46.42 48.77,46.42 46.67,44.32 | v46.67,40.83 46.67,44.32 | R6.1 14.61,57.78 21.59,50.8 27.5,50.8 33.85,44.45 46.42,44.45 46.67,44.32
D7(SCK)
  Bottom 0.6: IC4.8 61.21,43.18 56.13,38.1 54.61,38.1 52.83,39.88 J4.3
D8(RX0)
  Top 0.6: IC4.14 68.39,27.94 73.79,33.34 73.79,37.15 73.28,37.66 73.28,59.63 74.3,60.64 78.42,60.64 91.57,73.79 91.57,79.88 90.81,80.64 U$2.3
D9(TX0)  (via drill 0.6)
  Top 0.6: v92.2,72.01 92.77,72.58 92.77,80.39 91.25,81.92 U$2.2 | v74.99,58.93 74.99,32 68.39,25.4 IC4.15
  Bottom 0.6: v92.2,72.01 88.08,72.01 v74.99,58.93
D10(RX1)
  Top 0.6: IC2.2 33.72,27.43 31.88,29.27 31.88,31.94 37.34,37.4 44.07,37.4 58.61,22.86 IC4.16
D11(TX1)
  Bottom 0.6: IC2.15 54.04,27.43 61.15,20.32 IC4.17
D12  (via drill 0.6)
  Top 0.6: v46.86,14.73 IC2.10
  Bottom 0.6: v46.86,14.73 52.32,14.73 55.37,17.78 IC4.18
D13  (via drill 0.6)
  Top 0.406: 51.24,9.02 v51.44,9.21
  Top 0.6: IC2.7 35.12,14.73 40.83,9.02 51.24,9.02
  Bottom 0.6: IC4.19 57.72,15.24 51.63,9.14 v51.44,9.21
D14
  Bottom 0.6: IC4.20 67.06,13.08 R15.2 59.82,12.83 56.77,9.78 X10.2
D15  (via drill 0.51)
  Top 0.6: 89.09,25.91 89.09,31.88 90.17,32.96 90.42,32.96 v104.33,32.96
  Top 0.61: 89.09,25.91 89.09,15.94 85.85,12.7 IC4.21
  Bottom 0.6: v104.33,32.96 111.12,32.96 U$1.P$9
D16(SCL)  (via drill 0.6)
  Top 0.61: v87.25,21.4 87.25,17.91 84.58,15.24 IC4.22
  Bottom 0.6: v87.25,21.4 87.25,25.59 90.17,28.51 101.85,28.51 108.08,22.29 108.08,21.4 111.06,18.41 U$3.J1.4
D17(SDA)
  Bottom 0.6: IC4.23 87.95,17.78 92.08,13.65 95.82,13.65 97.6,15.43 97.6,19.49 98.74,20.64 106.3,20.64 111.06,15.88 U$3.J1.3
GND  (via drill 0.51, 0.6)
  Top 0.6: C3.1 89.98,83.19 U$2.1 | S1.1 69.03,1.84 69.03,8.32 S1.2 | S4.4 94.04,15.62 100.52,15.62 S4.3 | C11.2 52.83,35.56 C2.2 | v44.96,42.74 44.96,60.58 K1.K | v50.29,7.62 38.23,7.62 v37.59,8.26
  Bottom 0.6: 81.41,81.92 Y1.2 | JP3.GND 70.67,82.55 71.44,83.31 71.44,83.38 72.52,84.45 75.06,84.45 77.47,82.04 81.15,82.04 81.41,81.92 | C3.1 82.8,83.19 81.66,82.04 81.41,81.92 | IC2.13 IC2.12 41.78,19.68 41.21,19.68 38.42,16.89 38.23,16.7 | C11.2 C10.2 61.34,35.56 IC4.11 67.69,35.69 68.26,35.69 70.67,38.1 82.42,38.1 IC4.31 88.9,38.1 C5.2 | X77.2 54.1,86.87 | 54.1,86.87 X77.1 | 54.1,86.87 54.1,86.61 54.1,80.14 T2.E 53.98,79.63 53.98,78.11 51.5,75.63 51.5,64.9 51.5,64.64 | S1.1 68.96,1.78 64.45,1.78 63.25,0.57 55.94,0.57 53.91,2.6 X10.1 53.66,2.48 53.66,4.25 v50.29,7.62 | K6.K 7.75,61.59 | 7.75,61.59 13.21,61.59 K5.K 13.72,61.59 K4.K 21.34,61.59 K3.K 28.96,61.59 36.07,61.59 K2.K 43.69,61.59 K1.K 44.2,61.72 47.12,61.72 50.04,64.64 51.5,64.64 | 38.23,16.7 38.23,8.89 | 38.23,8.89 X11.1 38.48,3.17 | 38.23,16.7 34.67,20.26 IC2.5 34.42,22.1 IC2.4 34.67,21.65 37.15,24.13 37.15,30.73 36.83,31.05 36.83,32.64 | S4.4 94.04,15.62 94.04,18.67 S3.3 | S3.4 100.52,18.67 100.52,15.62 S4.3 100.78,15.43 104.78,15.43 109.16,11.05 109.16,10.79 | U$1.P$15 126.43,33.02 126.49,33.08 C7.2 126.68,36.39 128.27,37.97 129.73,37.97 130.87,36.83 130.87,30.23 111.51,10.86 U$3.J1.1 109.16,10.79 | 109.16,10.79 108.27,10.79 104.71,7.24 C6.2 101.54,6.99 100.58,7.94 S2.3 100.27,8 94.04,8 S2.4 93.79,7.81 75.69,7.81 74.3,6.41 70.93,6.41 69.03,8.32 S1.2 | 7.75,50.8 10.92,50.8 LED2.K | 7.75,50.8 C13.2 6.29,50.61 4.7,49.02 4.7,47.56 5.14,47.12 5.14,44.45 AC-DC-5V.-V | 7.75,50.8 7.75,51.05 7.75,61.34 7.75,61.59 | DIODE2.A 51.5,64.64 | 36.83,32.64 C9.2 | J4.6 55.37,42.67 53.59,44.45 49.53,44.45 48.39,43.31 48.39,38.67
  Bottom 0.6: 48.39,38.67 50.23,36.83 50.42,36.83 52.2,35.05 C2.2 | 46.61,38.42 40.83,32.64 37.08,32.64 36.83,32.64 | 46.61,38.42 46.74,38.54 48.13,38.54 48.39,38.67 | v44.96,42.74 44.96,40.07 46.42,38.61 46.61,38.42 | v37.59,8.26 38.23,8.89
  Bottom 0.61: JP3.GND 68.07,82.55 65.53,80.01 65.53,76.71 DIODE2.A
MV1.1
  Bottom 0.6: IC2.3 33.72,24.89 29.34,20.51 X7.2
MV1.2
  Bottom 0.6: IC2.6 33.72,17.27 31.88,15.43 X7.1
MV2.1
  Bottom 0.6: IC2.14 42.74,24.89 45.21,22.42 X8.1
MV2.2
  Bottom 0.6: IC2.11 41.34,17.27 39.5,15.43 39.5,6.48 X8.2
N$1
  Bottom 0.6: 57.91,30.48 57.91,29.84 X9.1 | 57.91,30.48 C11.1 | IC4.13 58.17,30.48 57.91,30.48
N$2
  Top 0.6: C10.1 X9.2
  Bottom 0.6: IC4.12 C10.1
N$3
  Bottom 0.6: JP2.P$1 10.35,9.59 10.35,14.99 AC-DC-5V.AC0
N$4
  Bottom 0.6: JP2.P$2 10.99,3.3 15.49,7.81 U$4.2
N$5
  Top 0.61: 0.13,71.75 44.58,71.75 48.39,75.56 48.39,89.53
N$6
  Bottom 0.6: R8.1 102.81,13.34 100.58,11.11 S4.1 100.27,11.11 94.04,11.11 S4.2
N$7
  Top 0.6: Y1.1 78.87,72.45 81.98,75.56 89.98,75.56 U$2.7
N$8
  Bottom 0.6: R10.P$1 LED2.A
N$9
  Top 0.6: Y1.3 86.87,72.39 88.77,74.3 89.98,74.3 U$2.8
N$10
  Top 0.6: R9.1 90.93,26.29 93.98,23.24 S3.1
  Bottom 0.6: R8.2 100.84,23.5 100.58,23.24 S3.2 100.27,23.24 94.04,23.24 S3.1
N$11
  Top 0.6: C4.2 95.69,80.64 U$2.14
N$12  (via drill 0.6)
  Top 0.6: v76.52,77.15 77.15,76.52 79.18,76.52 79.57,76.9 89.66,76.9 89.72,76.83 89.98,76.83 U$2.6
  Bottom 0.6: v76.52,77.15 73.15,80.52 JP3.D-
N$13
  Bottom 0.6: R12.2 59.05,79.76 T2.B
N$14
  Top 0.6: C3.2 87.76,79.38 89.98,79.38 U$2.4
N$16
  Bottom 0.6: K3.A R3.2
N$17
  Bottom 0.61: 0.13,71.75 44.58,71.75 48.39,75.56 48.39,89.53
N$18
  Bottom 0.6: X3.1 27.43,83.19 JP9.1 28.7,81.66 K3.DS1
N$19
  Bottom 0.6: IC2.8 34.42,4.57 X11.2
N$22  (via drill 0.6)
  Top 0.6: v78.49,78.17 89.66,78.17 89.72,78.11 89.98,78.11 U$2.5
  Bottom 0.6: v78.49,78.17 78.04,78.17 73.66,82.55 73.15,82.55 JP3.D+
N$23
  Bottom 0.6: X3.2 29.97,85.79 31.24,84.52 31.24,76.83 K3.DS2
N$24
  Bottom 0.6: K2.A R2.2
N$25
  Bottom 0.6: X2.1 35.05,83.19 JP11.1 36.32,81.66 K2.DS1
N$26
  Bottom 0.6: X2.2 37.59,85.79 38.86,84.52 38.86,76.83 K2.DS2
N$28
  Bottom 0.6: K4.A R4.2
N$29
  Bottom 0.6: X4.1 19.81,83.19 JP8.1 21.08,81.66 K4.DS1
N$30
  Bottom 0.6: X4.2 22.35,85.79 23.62,84.52 23.62,76.83 K4.DS2
N$31
  Bottom 0.6: R1.2 48.39,68.58 K1.A
N$32
  Bottom 0.6: X1.1 42.67,83.19 JP12.1 43.94,81.66 K1.DS1
N$33
  Bottom 0.6: X1.2 45.21,85.79 46.48,84.52 46.48,76.83 K1.DS2
N$34
  Bottom 0.6: K6.A R6.2
N$35
  Bottom 0.6: X6.1 4.57,83.19 JP5.1 5.84,81.66 K6.DS1
N$36
  Bottom 0.6: X6.2 7.11,85.79 8.38,84.52 8.38,76.83 K6.DS2
N$37
  Bottom 0.6: R5.2 16.64,67.31 K5.A
N$38
  Bottom 0.6: X5.1 12.19,83.19 JP7.1 13.46,81.66 K5.DS1
N$39
  Bottom 0.6: X5.2 14.73,85.79 16,84.52 16,76.83 K5.DS2
VCC  (via drill 0.51, 0.6)
  Top 0.6: IC2.16 39.5,29.97 | 39.5,29.97 IC2.1 | 82.93,84.96 93.73,84.96 95.38,83.31 U$2.16 | 39.5,29.97 39.5,29.72 39.5,14.03 41.34,12.19 IC2.9 42.29,12.06 55.31,12.06 v59.31,8.06 | R11.2 90.93,30.04 97.6,23.37 97.6,23.11 97.6,22.42 98.74,21.27 103.12,21.27 106.93,17.46 v107.89,16.51 | 70.61,61.91 70.61,40.83 v70.67,40.77 | 70.61,61.91 v70.61,63.44 | J4.2 50.29,47.31 65.79,62.8 69.09,62.8 70.17,61.72 | 70.48,61.4 70.17,61.72 | 70.17,61.72 70.36,61.91 70.61,61.91
  Top 0.61: C6.1 107.44,13.34 107.44,16.07 v107.89,16.51 | 82.93,84.96 81.28,84.96 73.15,76.83 v70.61,76.83
  Bottom 0.6: 67.31,38.29 IC4.10 | v59.31,8.06 X10.3 63.12,3.3 R15.1 63.94,3.75 77.72,3.75 79.57,1.91 R7.P$2 87.38,1.78 87.63,1.52 102.36,1.52 107.44,6.6 C6.1 | U$3.J1.2 111.51,13.4 128.78,30.67 128.78,32.7 U$1.P$16 129.03,33.21 C7.1 | U$3.J1.2 v107.89,16.51 U$3.J1.2 | C13.1 9.59,48.26 13.4,44.45 20.57,44.45 AC-DC-5V.+V 20.83,44.64 23.72,47.53 | R10.P$2 25.08,48.9 23.72,47.53 | IC4.10 66.99,38.23 58.1,38.23 53.98,34.1 53.98,34.04 52.96,33.02 51.44,33.02 49.66,34.8 C2.1 49.4,34.67 46.74,34.67 IC2.16 | v70.61,63.44 v70.61,76.83 70.61,80.01 70.61,80.52 JP3.VBUS | v70.67,40.77 70.67,40.39 68.45,38.16 67.75,38.16 IC4.10 | 23.72,47.53 23.88,47.37 L1.P$2 30.73,40.39 30.73,33.66 IC2.1
  Bottom 0.61: v70.61,76.83 70.61,80.01

### Text on the board
Milling: SauleVire.lt